# Altium schematic sheet FTDI.SchDoc
size A4
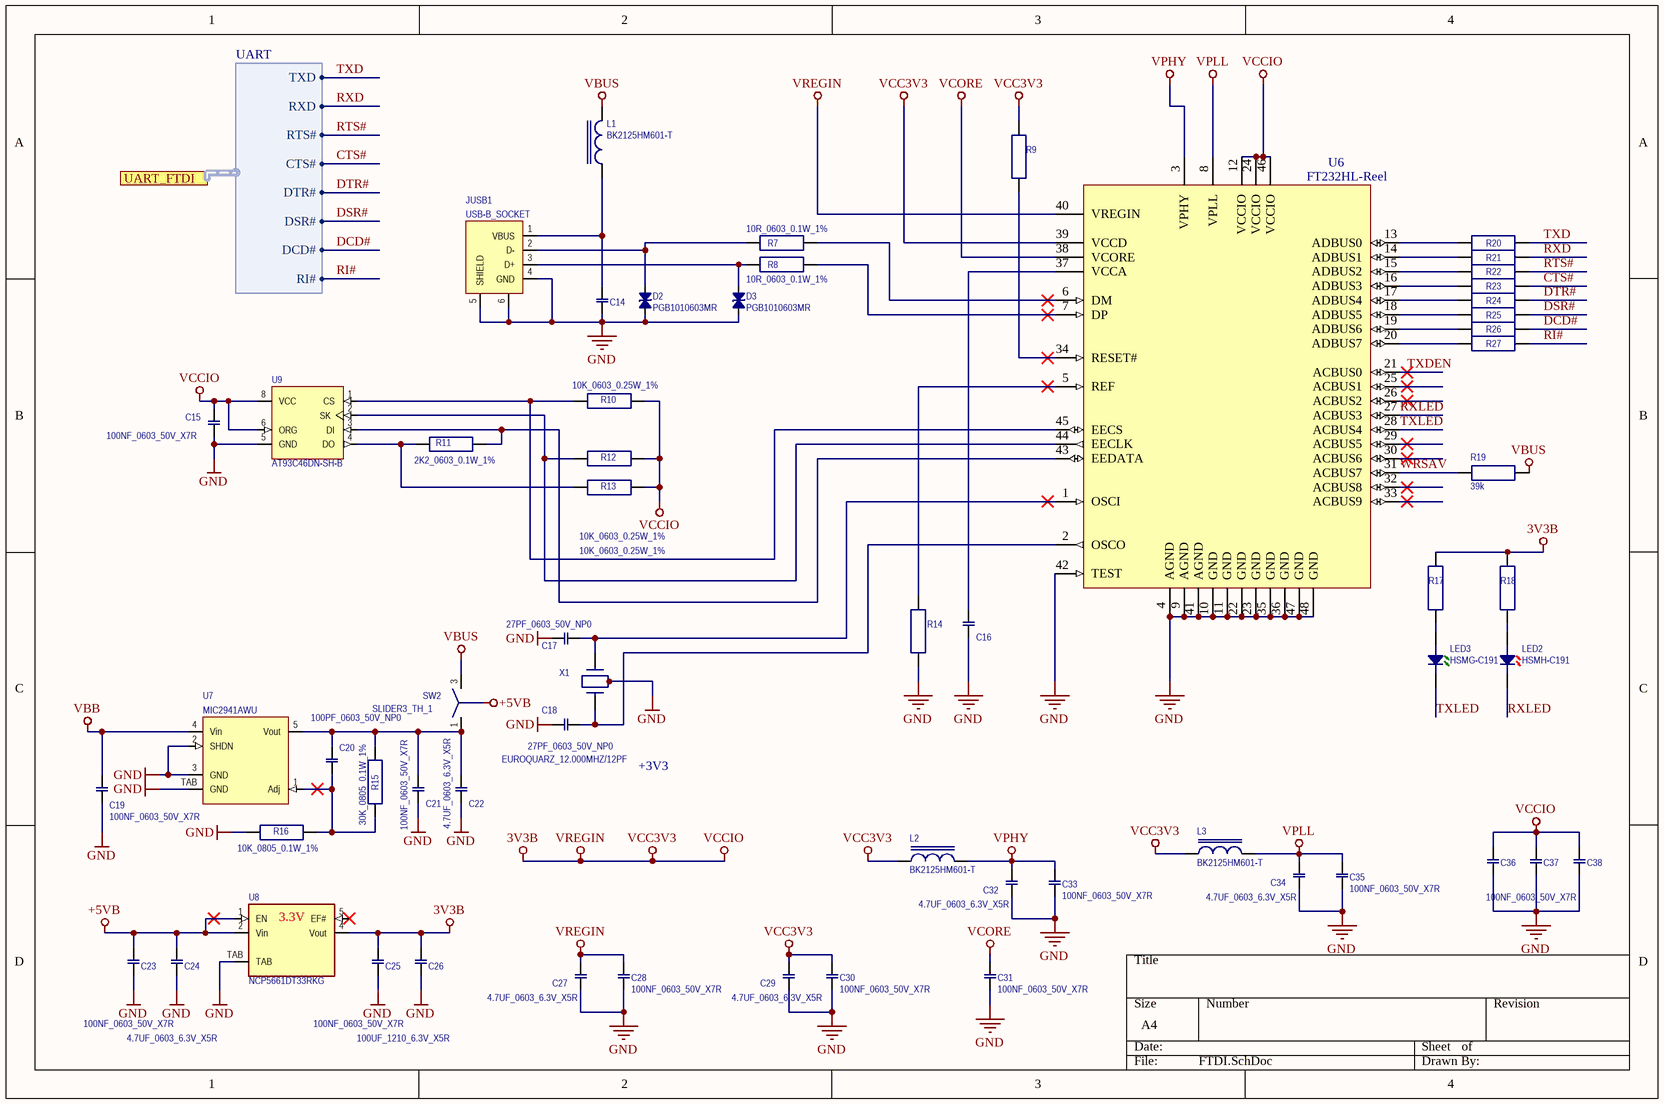
[diagram p0: FTDI.SchDoc]

## Parts
C14  10NF_0603_50V_X7R  [CAP0603]  (value not drawn)
C15  100NF_0603_50V_X7R  [CAP0603]
C16  100NF_0603_50V_X7R  [CAP0603]  (value not drawn)
C17  27PF_0603_50V_NP0  [CAP0603]
C18  27PF_0603_50V_NP0  [CAP0603]
C19  100NF_0603_50V_X7R  [CAP0603]
C20  100PF_0603_50V_NP0  [CAP0603]
C21  100NF_0603_50V_X7R  [CAP0603]
C22  4.7UF_0603_6.3V_X5R  [CAP0603]
C23  100NF_0603_50V_X7R  [CAP0603]
C24  4.7UF_0603_6.3V_X5R  [CAP0603]
C25  100NF_0603_50V_X7R  [CAP0603]
C26  100UF_1210_6.3V_X5R  [CAP1210]
C27  4.7UF_0603_6.3V_X5R  [CAP0603]
C28  100NF_0603_50V_X7R  [CAP0603]
C29  4.7UF_0603_6.3V_X5R  [CAP0603]
C30  100NF_0603_50V_X7R  [CAP0603]
C31  100NF_0603_50V_X7R  [CAP0603]
C32  4.7UF_0603_6.3V_X5R  [CAP0603]
C33  100NF_0603_50V_X7R  [CAP0603]
C34  4.7UF_0603_6.3V_X5R  [CAP0603]
C35  100NF_0603_50V_X7R  [CAP0603]
C36  100NF_0603_50V_X7R  [CAP0603]  (value not drawn)
C37  100NF_0603_50V_X7R  [CAP0603]
C38  100NF_0603_50V_X7R  [CAP0603]  (value not drawn)
D2  PGB1010603MR  [0603]
D3  PGB1010603MR  [0603]
JUSB1  USB-B_SOCKET  [USB-B_SOCKET]
L1  BK2125HM601-T  [L0805]
L2  BK2125HM601-T  [L0805]
L3  BK2125HM601-T  [L0805]
LED2  HSMH-C191  [D0603]
LED3  HSMG-C191  [D0603]
R7  10R_0603_0.1W_1%  [R0603]
R8  10R_0603_0.1W_1%  [R0603]
R9  10K_0603_0.25W_1%  [R0603]  (value not drawn)
R10  10K_0603_0.25W_1%  [R0603]
R11  2K2_0603_0.1W_1%  [R0603]
R12  10K_0603_0.25W_1%  [R0603]
R13  10K_0603_0.25W_1%  [R0603]
R14  12K_0603_0.25W_1%  [R0603]  (value not drawn)
R15  30K_0805_0.1W_1%  [R0805]
R16  10K_0805_0.1W_1%  [R0805]
R17  47R_0603_0.1W_1%  [R0603]  (value not drawn)
R18  62R_0603_0.1W_1%  [R0603]  (value not drawn)
R19  39k  [R0603]
R20  100R_0603_0.1W_1%  [R0603]  (value not drawn)
R21  100R_0603_0.1W_1%  [R0603]  (value not drawn)
R22  100R_0603_0.1W_1%  [R0603]  (value not drawn)
R23  100R_0603_0.1W_1%  [R0603]  (value not drawn)
R24  100R_0603_0.1W_1%  [R0603]  (value not drawn)
R25  100R_0603_0.1W_1%  [R0603]  (value not drawn)
R26  100R_0603_0.1W_1%  [R0603]  (value not drawn)
R27  100R_0603_0.1W_1%  [R0603]  (value not drawn)
SW2  SLIDER3_TH_1  [X3APH-SLIDER]
U6  FT232HL-Reel  [LQFP-48_N]
U7  MIC2941AWU  [TO263_5]
U8  NCP5661DT33RKG  [DPAK5]
U9  AT93C46DN-SH-B  [SOIC8]
X1  EUROQUARZ_12.000MHZ/12PF  [EUROQUARZ_3.2X5.0MM]

## Ports
UART_FTDI (harness UART)

## Harnesses
UART: TXD, RXD, RTS#, CTS#, DTR#, DSR#, DCD#, RI#

## Nets
3V3B: C15.1 C25.1 C26.1 C27.1 C28.1 C29.1 C30.1 C36.1 C37.1 C38.1 L2.1 L3.1 R9.2 R10.2 R12.2 R13.2 R17.2 R18.2 U6.12(VCCIO) U6.24(VCCIO) U6.39(VCCD) U6.40(VREGIN) U6.46(VCCIO) U8.4(Vout) U9.6(ORG) U9.8(VCC)  [also labelled VCC3V3, VCCIO, VREGIN]
+5VB: C23.1 C24.1 SW2.2 U8.1(EN) U8.2(Vin)
GND: C14.2 C15.2 C16.2 C17.2 C18.2 C19.1 C21.2 C22.2 C23.2 C24.2 C25.2 C26.2 C27.2 C28.2 C29.2 C30.2 C31.2 C32.2 C33.2 C34.2 C35.2 C36.2 C37.2 C38.2 D2.1 D3.1 JUSB1.4(GND) JUSB1.5(SHIELD) JUSB1.6(SHIELD) R14.1 R16.1 U6.4(AGND) U6.9(AGND) U6.10(GND) U6.11(GND) U6.22(GND) U6.23(GND) U6.35(GND) U6.36(GND) U6.41(AGND) U6.42(TEST) U6.47(GND) U6.48(GND) U7.2(SHDN) U7.3(GND) U7.TAB(GND) U8.TAB U9.5(GND) X1.2 X1.4  [also labelled SHIELD]
VBB: C19.2 U7.4(Vin)
VBUS: L1.2 R19.2 SW2.3
VCORE: C31.1 U6.38(VCORE)
VPHY: C32.1 C33.1 L2.2 U6.3(VPHY)
VPLL: C34.1 C35.1 L3.2 U6.8(VPLL)
CTS#: R23.2 ; port UART_FTDI.CTS#
DCD#: R26.2 ; port UART_FTDI.DCD#
DSR#: R25.2 ; port UART_FTDI.DSR#
DTR#: R24.2 ; port UART_FTDI.DTR#
RI#: R27.2 ; port UART_FTDI.RI#
RTS#: R22.2 ; port UART_FTDI.RTS#
RXD: R21.2 ; port UART_FTDI.RXD
RXLED: LED2.K U6.27(ACBUS3)
TXD: R20.2 ; port UART_FTDI.TXD
TXDEN: U6.21(ACBUS0)
TXLED: LED3.K U6.28(ACBUS4)
WRSAV: R19.1 U6.31(ACBUS7)
NetC14_1: C14.1 JUSB1.1(VBUS) L1.1
NetC16_1: C16.1 U6.37(VCCA)
NetC17_1: C17.1 U6.1(OSCI) X1.3
NetC18_1: C18.1 U6.2(OSCO) X1.1
NetC20_1: C20.1 R15.2 R16.2 U7.1(Adj)
NetC20_2: C20.2 C21.1 C22.1 R15.1 SW2.1 U7.5(Vout)
NetD2_2: D2.2 JUSB1.2(D-) R7.1
NetD3_2: D3.2 JUSB1.3(D+) R8.1
NetLED2_A: LED2.A R18.1
NetLED3_A: LED3.A R17.1
NetR7_2: R7.2 U6.6(DM)
NetR8_2: R8.2 U6.7(DP)
NetR9_1: R9.1 U6.34(RESET#)
NetR10_1: R10.1 U6.45(EECS) U9.1(CS)
NetR11_1: R11.1 R13.1 U9.4(DO)
NetR11_2: R11.2 U6.43(EEDATA) U9.3(DI)
NetR12_1: R12.1 U6.44(EECLK) U9.2(SK)
NetR14_2: R14.2 U6.5(REF)
NetR20_1: R20.1 U6.13(ADBUS0)
NetR21_1: R21.1 U6.14(ADBUS1)
NetR22_1: R22.1 U6.15(ADBUS2)
NetR23_1: R23.1 U6.16(ADBUS3)
NetR24_1: R24.1 U6.17(ADBUS4)
NetR25_1: R25.1 U6.18(ADBUS5)
NetR26_1: R26.1 U6.19(ADBUS6)
NetR27_1: R27.1 U6.20(ADBUS7)

Not connected (* = marked no-connect by the designer): U6 25(ACBUS1)* 26(ACBUS2)* 29(ACBUS5)* 30(ACBUS6)* 32(ACBUS8)* 33(ACBUS9)*; U8 5(EF#)*

## Notes on the sheet
- +3V3
- (in symbol NCP5661DT33RKG) 3.3V

## Library data of the parts
C14-C16 C19 C21 C23 C25 C28 C30 C31 C33 C35-C38 = 100NF_0603_50V_X7R: 128-8255    Capacitor MLC-X7R_0603_100NF_10%_50V; C0603C104K5RAC; KEMET; RoHS=Yes
C17 C18 = 27PF_0603_50V_NP0: 141-4627    Capacitor MLC-NPO_0603_27PF_5%_50V; C0603C270J5GAC; KEMET; RoHS=Yes
C20 = 100PF_0603_50V_NP0: 141-4603    Capacitor MLC-NPO_0603_100PF_5%_50V; C0603C101J5GAC; KEMET; RoHS=Yes
C22 C24 C27 C29 C32 C34 = 4.7UF_0603_6.3V_X5R: 940-2110    Capacitor MLC-X5R_0603_4.7uF_10%_6.3V; 225520613672; PHYCOMP; RoHS=Yes
C26 = 100UF_1210_6.3V_X5R: 182-8817    Capacitor CML 100uF_1210_6.3V_X5R_20%; GRM32ER60J107ME20L; MURATA; RoHS=Yes
D2 D3 = PGB1010603MR: 175-7240   SUPPRESSOR, ESD, 15KV; PGB1010603MR; LITTELFUSE; RoHS=Yes
JUSB1 = USB-B_SOCKET: 117-7885    USB PANEL SOCKET PCB TYPE B; 2411 02; LUMBERG; RoHS=Yes
L1-L3 = BK2125HM601-T: 161-1995    FERRITE CHIP BEAD 500mA, 600Ohm@100MHz; BK2125HM601-T; TAIYO YUDEN; RoHS=Yes
LED2 = HSMH-C191: 855-4650    LED DIODE RED 25mA, 0603; HSMH-C191; AVAGO TECHNOLOGIES; RoHS=Yes
LED3 = HSMG-C191: 855-4617    LED DIODE GREEN 20mA, 0603; HSMG-C191; AVAGO TECHNOLOGIES; RoHS=Yes
R7 R8 R17 R18 = 10R_0603_0.1W_1%: 146-9751    RESISTOR MF_0603_10R_0.1W_1%_75V; CRCW060310R0FKEA; VISHAY; RoHS=Yes
R9 R10 R12 R13 = 10K_0603_0.25W_1%: 173-8918    RESISTOR MF_0603_10K_0.25W_1%; CRCW06010K0FKEAHP VISHAY; RoHS=Yes
R11 = 2K2_0603_0.1W_1%: 146-9765    RESISTOR MF_0603_2K2_0.1W_1%_75V; CRCW06032K20FKEA; VISHAY; RoHS=Yes
R14 = 12K_0603_0.25W_1%: 173-8919    RESISTOR MF_0603_12KR_0.25W_1%_75V; MC 0.250W 0603 1% 12K; CRCW060312K0FKEAHP VISHAY; RoHS=Yes
R15 = 30K_0805_0.1W_1%: 933-3002    RESISTOR MF_0805_30K_0.1W_1%_100V; MC 0.1W 0805 1% 30K; MULTICOMP; RoHS=Yes (repl. for 321-8235)
R16 = 10K_0805_0.1W_1%: 933-2391    RESISTOR MF_0805_10K_0.1W_1%_100V; MC 0.1W 0805 1% 10K; MULTICOMP; RoHS=Yes (repl. for 911-975)
R19 = 0.0R_0603_0.063W_5%: 923-3130    RESISTOR MF_0603_0.0R_0.1W_50V; RC0603JR-070RL; YAGEO; RoHS=Yes
R20-R27 = 100R_0603_0.1W_1%: 146-9752    RESISTOR MF_0603_100R_0.1W_1%_75V; CRCW0603100RFKEA; VISHAY; RoHS=Yes
SW2 = SLIDER3_TH_1: 674-345     SWITCH SLIDE SPDT VERT; 09-03290-01; EAO; RoHS=Yes
U6 = FT232HL-Reel: Single Channel Hi-Speed USB to Multipurpose UART/FIFO IC, 48-pin LQFP, Tape and Reel; Manufacturer: FTDI; DatasheetVersion: ver 1.8, Dec-2012; PackageVersion: Dec-12; PackageReference: LQFP-48; PackageDescription: 48-Pin Thin Quad Flat Pack, 7 x 7 mm Body, 0.5 mm Pitch; PartNumber: FT232HL-Reel; ComponentLink1Description: Manufacturer URL; ComponentLink1URL: http://www.ftdichip.com/; ComponentLink2Description: Datasheet; ComponentLink2URL: http://www.ftdichip.com/Support/Documents/DataSheets/ICs/DS_FT232H.pdf
U7 = MIC2941AWU: 155-6739    VOLTAGE REGULATOR, ADJ/1,5A, MIC2941AWU; MICREL; RoHS=Yes
U8 = NCP5661DT33RKG: ONSEMI      VOLTAGE REGULATOR NCP5661DT33RKG, LINEAR, LDO, 3.3V/1A, DPAK5; ONSEMI; RoHS=Yes
U9 = AT93C46DN-SH-B: 145-5086    EEPROM 1kBit; AT93C46DN-SH-B; SOIC8; ATMEL; RoHS=Yes
X1 = EUROQUARZ_12.000MHZ/12PF: 164-0927    CRYSTAL, SMD, 12.000MHZ MJ/30/30/40/12PF; EUROQUARZ RoHS=Yes